# Altium project TS12A4514DBVR.PrjPcb
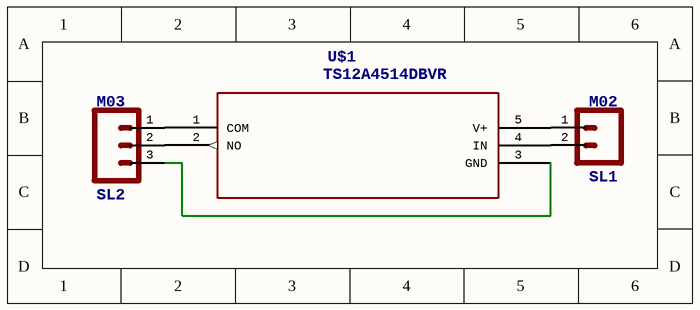
[diagram p0: TS12A4514DBVR.SchDoc]
1 sheet, 3 parts. Net scope: global (net labels, ports and power ports of the same name join across sheets).
Board file: TS12A4514DBVR.PcbDoc

## Sheet TS12A4514DBVR.SchDoc
size 99 x 42 mm

### Parts
SL1  M02  [02P]
SL2  M03  [03P]
U$1  TS12A4514DBVR  [DBV5]

### Nets
NetSL1_1: SL1.1 U$1.5(V+)
NetSL1_2: SL1.2 U$1.4(IN)
NetSL2_1: SL2.1 U$1.1(COM)
NetSL2_2: SL2.2 U$1.2(NO)
NetSL2_3: SL2.3 U$1.3(GND)

### Library data of the parts
SL1 = M02: <b>AMP QUICK CONNECTOR</b>; OC_FARNELL: unknown; OC_NEWARK: unknown
SL2 = M03: <b>AMP QUICK CONNECTOR</b>; OC_FARNELL: unknown; OC_NEWARK: unknown
U$1 = TS12A4514DBVR: MANUFACTURER: Texas Instruments; 3D_LIBRARY_NAME: TI_AllParts_20121225; FAMILY_NAME: ANALOG SWITCH OR MULTIPLEXER greater than 5V; INDUSTRY_STD_PKG_TYPE: SOT23; PACKAGE_DESIGNATOR: DBV; PIN_COUNT: 5; COPYRIGHT: Copyright C 2015 Accelerated Designs. All rights reserved; DATASHEETURL: httpwww.ti.comlitgpnTS12A4514; GENERIC_PART_NUMBER: TS12A4514; MANUFACTURER_PART_NUMBER: TS12A4514DBVR; VENDOR: Texas Instruments